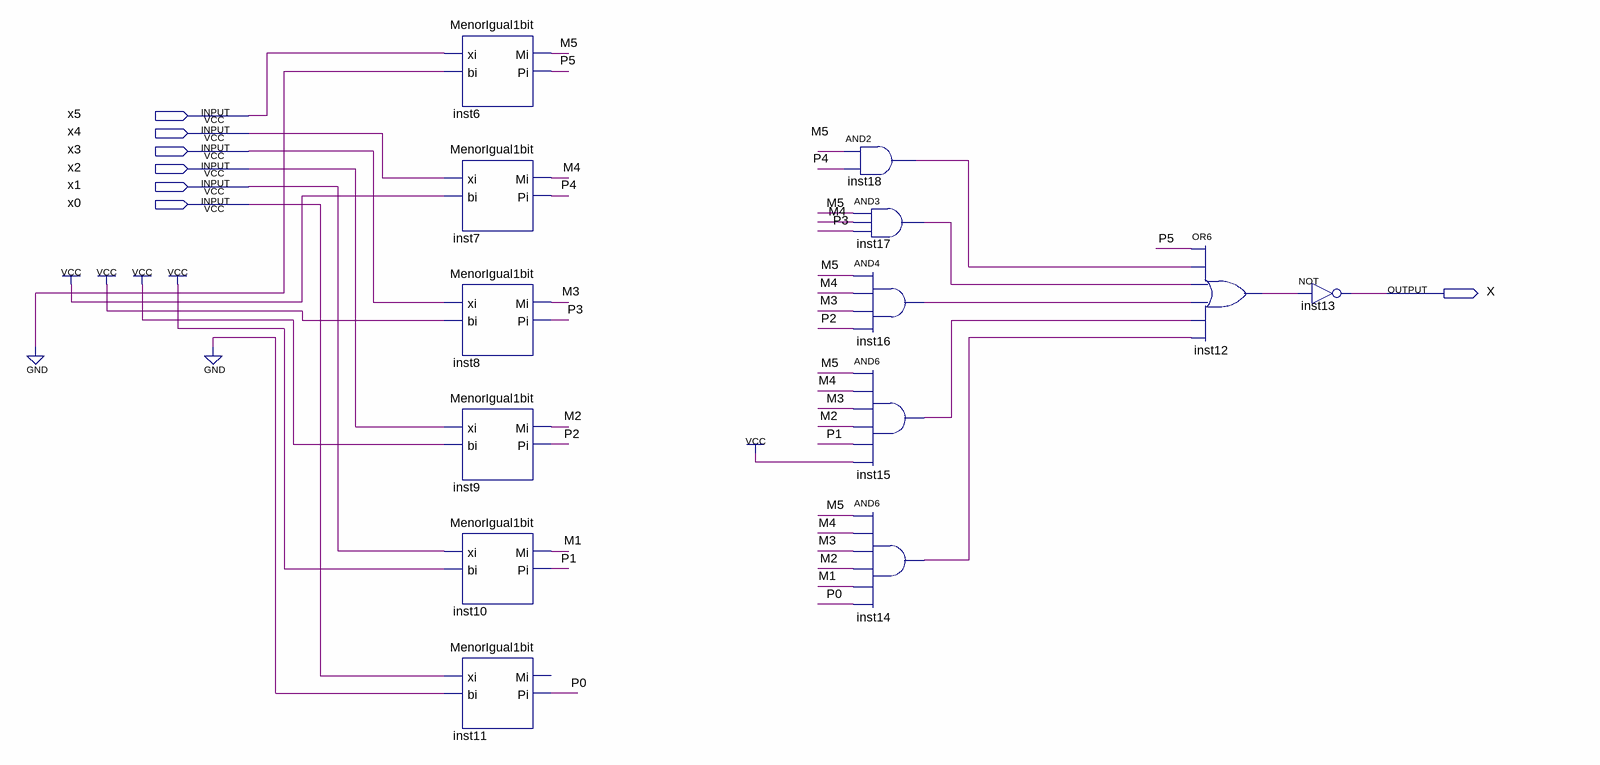
[diagram p0: schematic sheet]
// Quartus schematic MayorIgualA30.bdf as structural Verilog: 13 symbols, 7 pins
module MayorIgualA30 (
  input  x5,
  input  x4,
  input  x3,
  input  x2,
  input  x1,
  input  x0,
  output X
);

  wire inst12_out, inst14_out, inst15_out, inst16_out, inst17_out, inst18_out, M1, M2, M3, M4, M5, P0, P1,
       P2, P3, P4, P5;

  MenorIgual1bit inst6 (.xi(x5), .bi(1'b0), .Mi(M5), .Pi(P5));
  MenorIgual1bit inst7 (.xi(x4), .bi(1'b1), .Mi(M4), .Pi(P4));
  MenorIgual1bit inst8 (.xi(x3), .bi(1'b1), .Mi(M3), .Pi(P3));
  MenorIgual1bit inst9 (.xi(x2), .bi(1'b1), .Mi(M2), .Pi(P2));
  MenorIgual1bit inst10 (.xi(x1), .bi(1'b1), .Mi(M1), .Pi(P1));
  MenorIgual1bit inst11 (.xi(x0), .bi(1'b0), .Pi(P0));  // open: Mi
  and inst18 (inst18_out, M5, P4);
  and inst17 (inst17_out, M5, M4, P3);
  and inst16 (inst16_out, M5, M4, M3, P2);
  and inst15 (inst15_out, M5, M4, M3, M2, P1, 1'b1);
  and inst14 (inst14_out, M5, M4, M3, M2, M1, P0);
  or inst12 (inst12_out, P5, inst18_out, inst17_out, inst16_out, inst15_out, inst14_out);
  not inst13 (X, inst12_out);
endmodule
